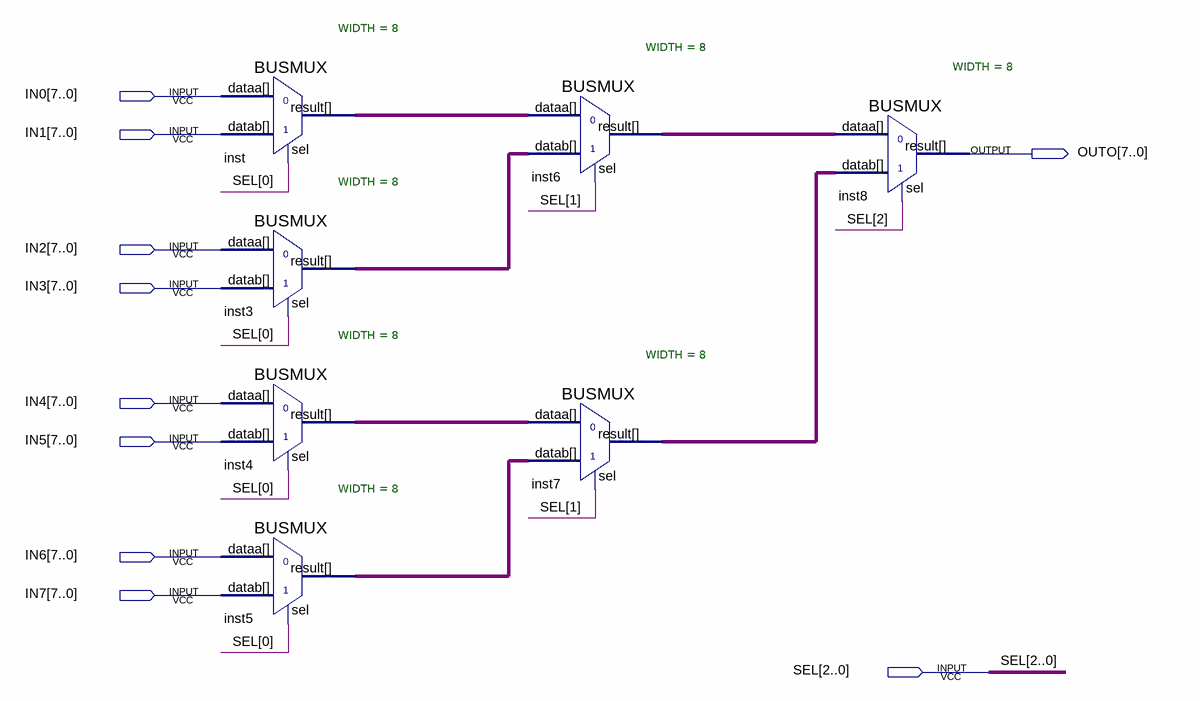
[diagram p0: schematic sheet]
// Quartus schematic Select8x8.bdf as structural Verilog: 7 symbols, 10 pins
module Select8x8 (
  input  [7:0] IN0,
  input  [7:0] IN1,
  input  [7:0] IN2,
  input  [7:0] IN3,
  input  [7:0] IN4,
  input  [7:0] IN5,
  input  [7:0] IN6,
  input  [7:0] IN7,
  input  [2:0] SEL,
  output [7:0] OUTO
);

  wire [7:0] inst3_result, inst4_result, inst5_result, inst6_result, inst7_result, inst_result;

  BUSMUX #(.WIDTH(8)) inst (.datab(IN1), .sel(SEL[0]), .dataa(IN0), .result(inst_result));
  BUSMUX #(.WIDTH(8)) inst3 (.datab(IN3), .sel(SEL[0]), .dataa(IN2), .result(inst3_result));
  BUSMUX #(.WIDTH(8)) inst4 (.datab(IN5), .sel(SEL[0]), .dataa(IN4), .result(inst4_result));
  BUSMUX #(.WIDTH(8)) inst5 (.datab(IN7), .sel(SEL[0]), .dataa(IN6), .result(inst5_result));
  BUSMUX #(.WIDTH(8)) inst6 (.datab(inst3_result), .sel(SEL[1]), .dataa(inst_result), .result(inst6_result));
  BUSMUX #(.WIDTH(8)) inst7 (.datab(inst5_result), .sel(SEL[1]), .dataa(inst4_result), .result(inst7_result));
  BUSMUX #(.WIDTH(8)) inst8 (.datab(inst7_result), .sel(SEL[2]), .dataa(inst6_result), .result(OUTO));
endmodule
